# EAGLE board SparkFun_Tsunami_Qwiic (EAGLE 9.6.2)
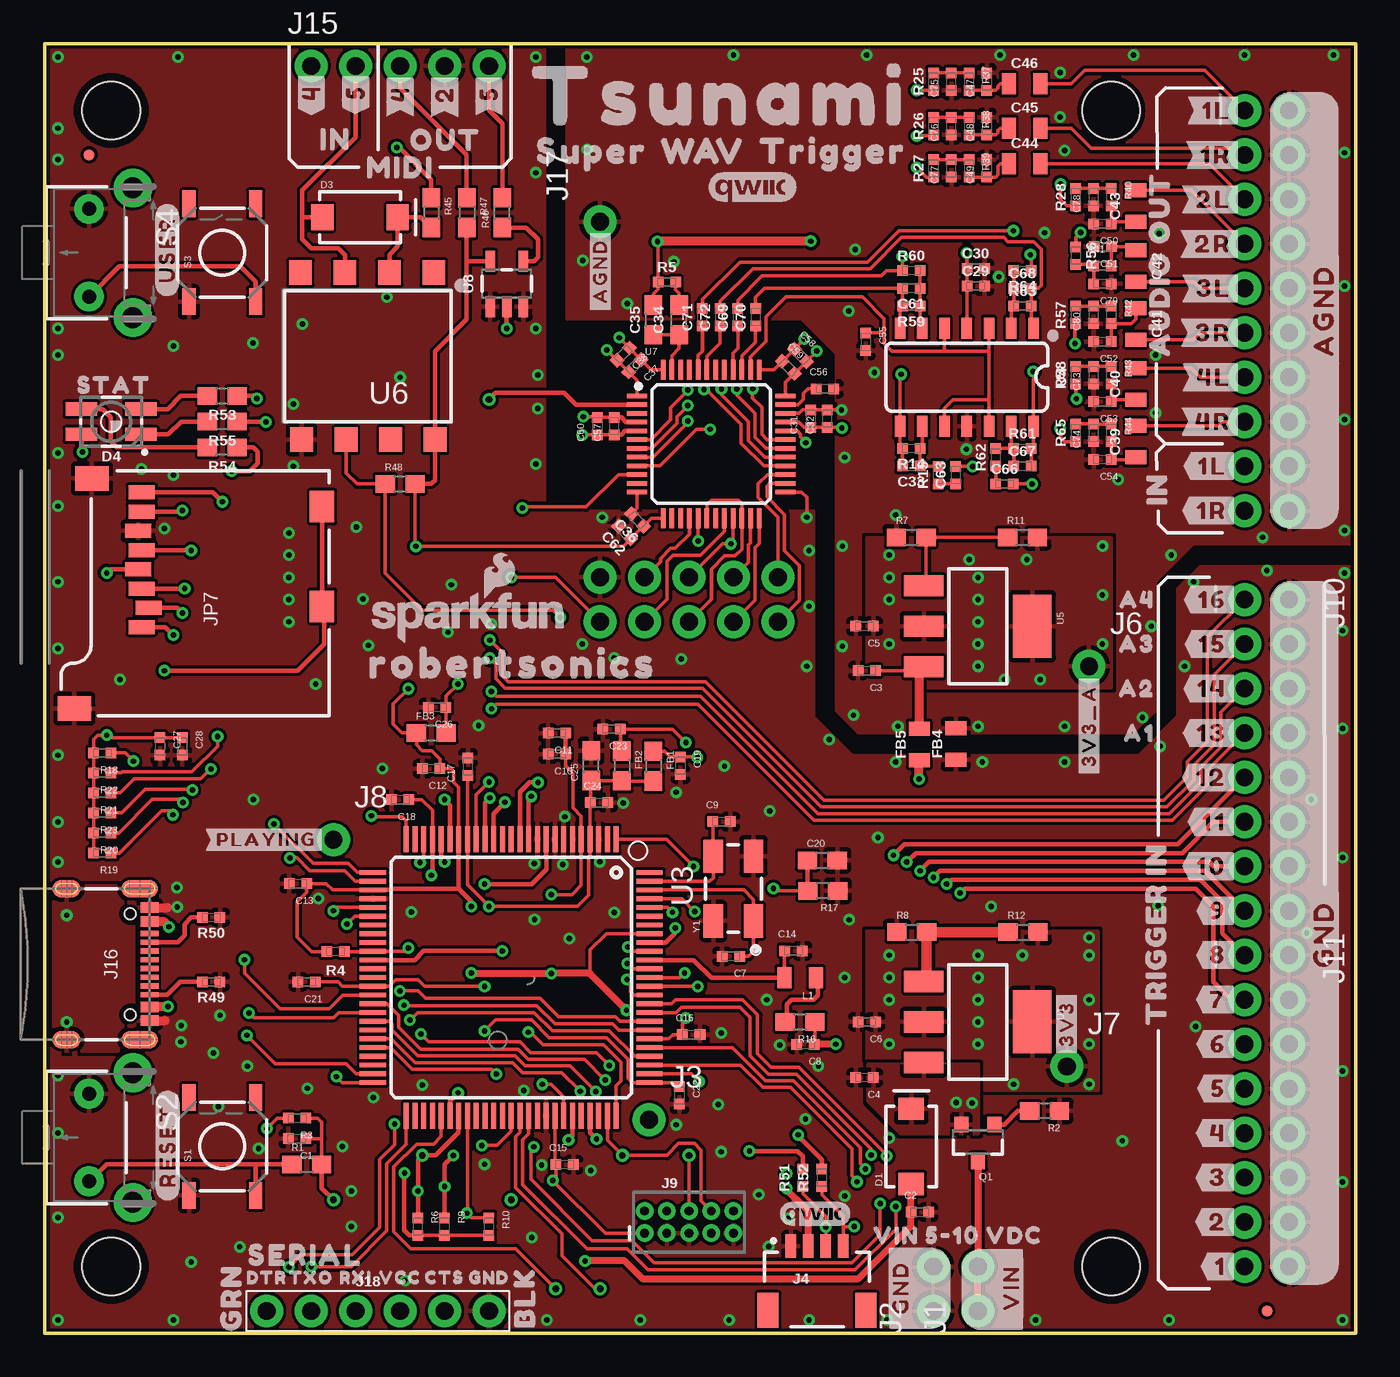
[diagram p2: board, top side]
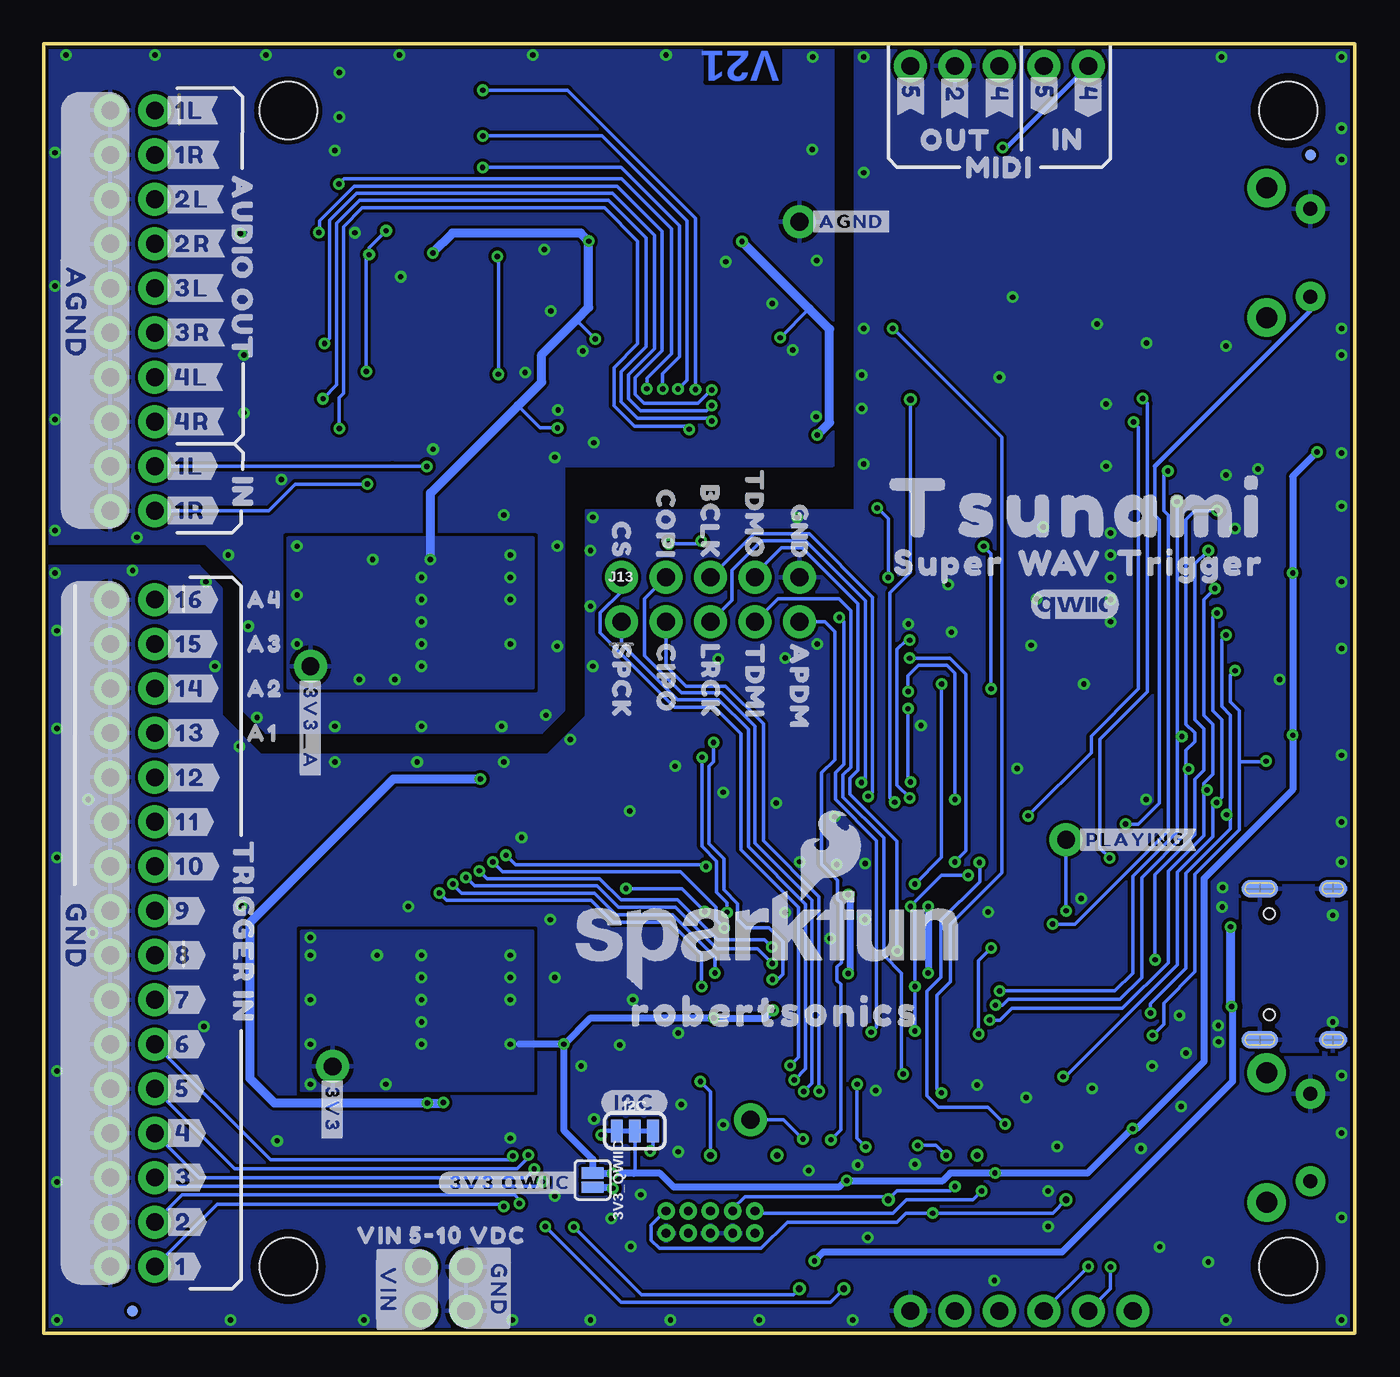
[diagram p3: board, bottom side, seen from below]

Size 74.93 x 73.66 mm. Coordinates in mm from the lower left corner, seen from the top.
Outline: 0,0 74.93,0 74.93,73.66 0,73.66 0,0
Copper layers (1*16): Top 0.035mm / dielectric 1.5mm / Bottom 0.035mm
Design rules "SparkFun-2-Layer-General-JLCPCB": minimum track width 7mil, minimum drill 0.3mm, track to track 7mil, track to pad 7mil, pad to pad 7mil, via to via 7mil, smd to smd 7mil, copper to edge 7mil, drill to drill 7mil, minimum pad ring 7mil, minimum via ring 7mil, stop-mask expansion 3mil, vias tented up to drill 25mil, thermal gap 10mil
tRestrict: area 29.3,27.8 to 29.5,28.6; area 29.8,27.8 to 30,28.6

## Footprints (pad centres in the part's own frame; a part is rotated, then mirrored left to right if it is on the bottom)
SMT-JUMPER_2_NO_SILK = smd 0.635 x 1.27: 1 -0.406,0; 2 0.406,0
0402-TIGHT = smd 0.6 x 0.6: 1 -0.5,0; 2 0.5,0
0603 = smd 1.1 x 1: 1 -0.85,0; 2 0.85,0
0805 = smd 0.8 x 1.2: 1 -0.9,0; 2 0.9,0
SMA-DIODE = smd 1.27 x 1.47: A -2.15,0; C 2.15,0
P-LCC-4-3 = smd 1.8 x 0.75: 1 -1.7,0.725; 2 -1.7,-0.725; 3 1.7,-0.725; 4 1.7,0.725
FIDUCIAL-MICRO = smd 0.635 x 0.635: 1 0,0
STAND-OFF = hole 3.302: 0,0
SMT-JUMPER_3_2-NC_TRACE_SILK = smd 0.66 x 1.27: 1 -1.041,0; 2 0,0; 3 1.041,0
1X02_NO_SILK = drill 1.016 pad 1.88: 1 0,0; 2 2.54,0
1X01_NO_SILK = drill 1.016 pad 1.88: 1 0,0
JST04_1MM_RA = smd 0.6 x 1.35: 1 -1.5,0; 2 -0.5,0; 3 0.5,0; 4 1.5,0 | smd 1.2 x 2: NC1 2.8,-3.675; NC2 -2.8,-3.675
2X5-PTH-1.27MM-NO_SILK = drill 0.508 pad 1: 1 -2.54,-0.635; 2 -2.54,0.635; 3 -1.27,-0.635; 4 -1.27,0.635; 5 0,-0.635; 6 0,0.635; 7 1.27,-0.635; 8 1.27,0.635; 9 2.54,-0.635; 10 2.54,0.635
2X8_NOSILK = drill 1.016 pad 1.88: 1 0,0; 2 0,2.54; 3 2.54,0; 4 2.54,2.54; 5 5.08,0; 6 5.08,2.54; 7 7.62,0; 8 7.62,2.54; 9 10.16,0; 10 10.16,2.54; 11 12.7,0; 12 12.7,2.54; 13 15.24,0; 14 15.24,2.54; 15 17.78,0; 16 17.78,2.54
2X5_NOSILK = drill 1.016 pad 1.88: 1 0,0; 2 0,2.54; 3 2.54,0; 4 2.54,2.54; 5 5.08,0; 6 5.08,2.54; 7 7.62,0; 8 7.62,2.54; 9 10.16,0; 10 10.16,2.54
2X10_NOSILK = drill 1.016 pad 1.88: 1 0,0; 2 0,2.54; 3 2.54,0; 4 2.54,2.54; 5 5.08,0; 6 5.08,2.54; 7 7.62,0; 8 7.62,2.54; 9 10.16,0; 10 10.16,2.54; 11 12.7,0; 12 12.7,2.54; 13 15.24,0; 14 15.24,2.54; 15 17.78,0; 16 17.78,2.54; 17 20.32,0; 18 20.32,2.54; 19 22.86,0; 20 22.86,2.54
1X05_NO_SILK = drill 1.016 pad 1.88: 1 0,0; 2 2.54,0; 3 5.08,0; 4 7.62,0; 5 10.16,0
USB-C-16P-4LAYER-ISOLATED = smd 0.3 x 1: A5 -1.25,-0.34; A6 -0.25,-0.34; A7 0.25,-0.34; A8 1.25,-0.34; B5 1.75,-0.34; B6 0.75,-0.34; B7 -0.75,-0.34; B8 -1.75,-0.34 | smd 0.6 x 1: GND -3.225,-0.34; GND2 3.225,-0.34; VBUS1 -2.45,-0.34; VBUS2 2.45,-0.34 | smd 1 x 2.1: SHLD1 -4.32,-0.915; SHLD2 4.32,-0.915 | smd 1 x 2.1 bottom: SHLD3 -4.32,-0.915; SHLD4 4.32,-0.915 | smd 1 x 1.6: SHLD5 -4.32,-5.095; SHLD8 4.32,-5.095 | smd 1 x 1.6 bottom: SHLD6 -4.32,-5.095; SHLD7 4.32,-5.095 | hole 0.65: -2.89,-1.445; 2.89,-1.445
6_PIN_SERIAL_TARGET_SIDE_W_SILK = drill 1.016 pad 1.88: 1 -6.35,0; 2 -3.81,0; 3 -1.27,0; 4 1.27,0; 5 3.81,0; 6 6.35,0
MICRO-SD-SOCKET-PP = smd 1.8 x 1.4: CD1 -2.05,0.4; CD2 -7.75,0.4 | smd 0.8 x 1.5: CS -7.84,10.3; DI -6.74,10.7; DO -2.34,10.7; GND -3.44,10.9; RSV1 -8.94,10.7; RSV2 -1.24,10.7; SCLK -4.54,10.7; VCC -5.64,10.9 | smd 1.4 x 1.9: GND1 -13.6,14.55; GND3 -0.45,13.55
SOT23-3 = smd 0.8 x 0.9: 1 -0.95,-1; 2 0.95,-1; 3 0,1.1
TACTILE_SWITCH_SMD_5.2MM = smd 1.524 x 0.762: 1 -2.794,1.905; 2 2.794,1.905; 3 -2.794,-1.905; 4 2.794,-1.905
TACTILE_SWITCH_PTH_RIGHT_ANGLE = drill 0.8 pad 1.7: 1 -2.5,0; 2 2.5,0 | drill 1.2 pad 2.2: ANCHOR1 -3.703,2.5; ANCHOR2 3.703,2.5
TP_15TH = drill 0.381 pad 0.61: 1 0,0
SOT223 = smd 1.219 x 2.235: 1 -2.311,-3.099; 2 0,-3.099; 3 2.311,-3.099 | smd 3.6 x 2.2: 4 0,3.099
LQFP100 = smd 1.5 x 0.28: 1 -7.9,6; 2 -7.9,5.5; 3 -7.9,5; 4 -7.9,4.5; 5 -7.9,4; 6 -7.9,3.5; 7 -7.9,3; 8 -7.9,2.5; 9 -7.9,2; 10 -7.9,1.5; 11 -7.9,1; 12 -7.9,0.5; 13 -7.9,0; 14 -7.9,-0.5; 15 -7.9,-1; 16 -7.9,-1.5; 17 -7.9,-2; 18 -7.9,-2.5; 19 -7.9,-3; 20 -7.9,-3.5; 21 -7.9,-4; 22 -7.9,-4.5; 23 -7.9,-5; 24 -7.9,-5.5; 25 -7.9,-6; 51 7.9,-6; 52 7.9,-5.5; 53 7.9,-5; 54 7.9,-4.5; 55 7.9,-4; 56 7.9,-3.5; 57 7.9,-3; 58 7.9,-2.5; 59 7.9,-2; 60 7.9,-1.5; 61 7.9,-1; 62 7.9,-0.5; 63 7.9,0; 64 7.9,0.5; 65 7.9,1; 66 7.9,1.5; 67 7.9,2; 68 7.9,2.5; 69 7.9,3; 70 7.9,3.5; 71 7.9,4; 72 7.9,4.5; 73 7.9,5; 74 7.9,5.5; 75 7.9,6 | smd 0.28 x 1.5: 26 -6,-7.9; 27 -5.5,-7.9; 28 -5,-7.9; 29 -4.5,-7.9; 30 -4,-7.9; 31 -3.5,-7.9; 32 -3,-7.9; 33 -2.5,-7.9; 34 -2,-7.9; 35 -1.5,-7.9; 36 -1,-7.9; 37 -0.5,-7.9; 38 0,-7.9; 39 0.5,-7.9; 40 1,-7.9; 41 1.5,-7.9; 42 2,-7.9; 43 2.5,-7.9; 44 3,-7.9; 45 3.5,-7.9; 46 4,-7.9; 47 4.5,-7.9; 48 5,-7.9; 49 5.5,-7.9; 50 6,-7.9; 76 6,7.9; 77 5.5,7.9; 78 5,7.9; 79 4.5,7.9; 80 4,7.9; 81 3.5,7.9; 82 3,7.9; 83 2.5,7.9; 84 2,7.9; 85 1.5,7.9; 86 1,7.9; 87 0.5,7.9; 88 0,7.9; 89 -0.5,7.9; 90 -1,7.9; 91 -1.5,7.9; 92 -2,7.9; 93 -2.5,7.9; 94 -3,7.9; 95 -3.5,7.9; 96 -4,7.9; 97 -4.5,7.9; 98 -5,7.9; 99 -5.5,7.9; 100 -6,7.9
SO14 = smd 0.6 x 1.2: 1 -3.175,-2.8; 2 -1.905,-2.8; 3 -0.635,-2.8; 4 0.635,-2.8; 5 1.905,-2.8; 6 3.175,-2.8; 7 4.445,-2.8; 8 4.445,2.8; 9 3.175,2.8; 10 1.905,2.8; 11 0.635,2.8; 12 -0.635,2.8; 13 -1.905,2.8; 14 -3.175,2.8
8-SMD = smd 1.3 x 1.4: 1 -3.96,-4.96; 2 -1.42,-4.96; 3 1.12,-4.96; 4 3.66,-4.96; 5 3.59,4.58; 6 1.05,4.58; 7 -1.49,4.58; 8 -4.03,4.58
LQFP-48 = smd 1.143 x 0.254: 1 -4.25,2.75; 2 -4.25,2.25; 3 -4.25,1.75; 4 -4.25,1.25; 5 -4.25,0.75; 6 -4.25,0.25; 7 -4.25,-0.25; 8 -4.25,-0.75; 9 -4.25,-1.25; 10 -4.25,-1.75; 11 -4.25,-2.25; 12 -4.25,-2.75; 25 4.25,-2.75; 26 4.25,-2.25; 27 4.25,-1.75; 28 4.25,-1.25; 29 4.25,-0.75; 30 4.25,-0.25; 31 4.25,0.25; 32 4.25,0.75; 33 4.25,1.25; 34 4.25,1.75; 35 4.25,2.25; 36 4.25,2.75 | smd 0.254 x 1.143: 13 -2.75,-4.25; 14 -2.25,-4.25; 15 -1.75,-4.25; 16 -1.25,-4.25; 17 -0.75,-4.25; 18 -0.25,-4.25; 19 0.25,-4.25; 20 0.75,-4.25; 21 1.25,-4.25; 22 1.75,-4.25; 23 2.25,-4.25; 24 2.75,-4.25; 37 2.75,4.25; 38 2.25,4.25; 39 1.75,4.25; 40 1.25,4.25; 41 0.75,4.25; 42 0.25,4.25; 43 -0.25,4.25; 44 -0.75,4.25; 45 -1.25,4.25; 46 -1.75,4.25; 47 -2.25,4.25; 48 -2.75,4.25
SOT23-5 = smd 0.55 x 1.2: 1 -0.95,-1.3; 2 0,-1.3; 3 0.95,-1.3; 4 0.95,1.3; 5 -0.95,1.3
CRYSTAL-OSC-SMD-5X3 = smd 1.9 x 1.1: 1 -1.85,-1.15; 2 1.85,-1.15; 3 1.85,1.15; 4 -1.85,1.15

## Placement (x,y rotation side)
3V3_QWIIC  [SMT-JUMPER_2_NO_SILK]  43.57,8.75 270 bottom
C1  10nF  [0402-TIGHT]  14.43,11.12 180 top
C2  10uF  [0402-TIGHT]  50.02,6.91 0 top
C3  0.1uF  [0402-TIGHT]  46.99,37.85 180 top
C4  0.1uF  [0402-TIGHT]  46.86,14.61 180 top
C5  10uF  [0402-TIGHT]  46.86,40.39 180 top
C6  10uF  [0402-TIGHT]  46.99,17.78 180 top
C7  12pF  [0402-TIGHT]  39.22,21.53 180 top
C8  0.1uF  [0402-TIGHT]  43.49,16.5 180 top
C9  12pF  [0402-TIGHT]  38.69,29.22 0 top
C10  0.1uF  [0402-TIGHT]  29.28,33.08 180 top
C11  10uF  [0402-TIGHT]  29.28,34.28 180 top
C12  0.1uF  [0402-TIGHT]  22.1,32.26 180 top
C13  0.1uF  [0402-TIGHT]  14.48,25.68 180 top
C14  4.7uF  [0402-TIGHT]  42.8,21.84 0 top
C15  0.1uF  [0402-TIGHT]  29.72,9.63 0 top
C16  0.1uF  [0402-TIGHT]  36.96,17.05 0 top
C17  0.1uF  [0402-TIGHT]  24.19,32.37 90 top
C18  0.1uF  [0402-TIGHT]  20.32,30.48 180 top
C19  0.1uF  [0402-TIGHT]  36.34,32.43 270 top
C20  10pF  [0603]  44.45,27.02 0 top
C21  0.1uF  [0402-TIGHT]  14.99,20.07 180 top
C22  0.1uF  [0402-TIGHT]  36.28,13.58 270 top
C23  0.1uF  [0402-TIGHT]  32.41,34.51 180 top
C24  0.1uF  [0402-TIGHT]  31.69,30.31 0 top
C25  2.2uF  [0603]  31.24,32.42 90 top
C26  0.1uF  [0402-TIGHT]  22.44,35.76 180 top
C27  10uF  [0402-TIGHT]  6.6,33.53 270 top
C28  0.1uF  [0402-TIGHT]  7.87,33.53 270 top
C29  0.1uF  [0402-TIGHT]  53.21,59.82 0 top
C30  1.0uF  [0402-TIGHT]  53.21,60.83 0 top
C31  0.1uF  [0402-TIGHT]  43.79,52.25 90 top
C32  1.0uF  [0402-TIGHT]  44.73,52.25 90 top
C33  100pF  [0402-TIGHT]  49.53,49.53 180 top
C34  5.6nF  [0603]  36.27,57.89 90 top
C35  390nF  [0603]  34.8,57.89 90 top
C36  0.1uF  [0402-TIGHT]  33.88,46.46 135 top
C37  0.1uF  [0402-TIGHT]  33.73,55.26 225 top
C38  1.0uF  [0402-TIGHT]  33.07,55.93 225 top
C39  22uF  [0805]  62.36,50.93 90 top
C40  22uF  [0805]  62.36,54.23 90 top
C41  22uF  [0805]  62.36,57.66 270 top
C42  22uF  [0805]  62.36,60.96 270 top
C43  22uF  [0805]  62.36,64.39 90 top
C44  22uF  [0805]  56.01,66.8 0 top
C45  22uF  [0805]  56.01,68.83 0 top
C46  22uF  [0805]  56.01,71.37 0 top
C47  0.1uF  [0402-TIGHT]  53.85,71.5 90 top
C48  0.1uF  [0402-TIGHT]  53.85,68.96 90 top
C49  0.1uF  [0402-TIGHT]  53.85,66.55 90 top
C50  0.1uF  [0402-TIGHT]  60.45,63.37 180 top
C51  0.1uF  [0402-TIGHT]  60.46,62.06 180 top
C52  0.1uF  [0402-TIGHT]  60.45,56.64 180 top
C53  0.1uF  [0402-TIGHT]  60.45,53.21 180 top
C54  0.1uF  [0402-TIGHT]  60.45,49.91 180 top
C55  0.1uF  [0402-TIGHT]  46.94,56.63 270 top
C56  0.1uF  [0402-TIGHT]  44.61,53.95 0 top
C57  0.1uF  [0402-TIGHT]  32.56,51.82 90 top
C58  1.0uF  [0402-TIGHT]  43.2,55.86 315 top
C59  0.1uF  [0402-TIGHT]  42.51,55.18 315 top
C60  1.0uF  [0402-TIGHT]  31.6,51.82 90 top
C61  100pF  [0402-TIGHT]  49.53,59.69 180 top
C62  1.0uF  [0402-TIGHT]  33.15,45.75 135 top
C63  1.0uF  [0402-TIGHT]  52.07,49.02 90 top
C66  1.0uF  [0402-TIGHT]  54.86,48.51 0 top
C67  100pF  [0402-TIGHT]  55.88,49.53 0 top
C68  100pF  [0402-TIGHT]  55.88,59.69 0 top
C69  1.0uF  [0402-TIGHT]  39.62,58.04 90 top
C70  1.0uF  [0402-TIGHT]  40.64,58.04 90 top
C71  1.0uF  [0402-TIGHT]  37.59,58.04 90 top
C72  1.0uF  [0402-TIGHT]  38.61,58.04 90 top
C73  0.1uF  [0402-TIGHT]  59.94,54.74 90 top
C74  0.1uF  [0402-TIGHT]  59.94,51.44 90 top
C75  0.1uF  [0402-TIGHT]  51.82,71.5 90 top
C76  0.1uF  [0402-TIGHT]  51.82,68.96 90 top
C77  0.1uF  [0402-TIGHT]  51.82,66.55 90 top
C78  0.1uF  [0402-TIGHT]  59.94,64.9 90 top
C79  0.1uF  [0402-TIGHT]  60.45,59.94 180 top
C80  0.1uF  [0402-TIGHT]  59.94,58.17 90 top
D1  1A/40V/500mV  [SMA-DIODE]  49.53,10.67 90 top
D3  1A/40V/500mV  [SMA-DIODE]  18.03,63.75 0 top
D4  RGB  [P-LCC-4-3]  3.81,52.07 180 top
FB1  470Ω  [0603]  34.79,32.39 270 top
FB2  470Ω  [0603]  32.99,32.41 270 top
FB3  470Ω  [0603]  22.1,34.29 0 top
FB4  600Ω  [0805]  52.07,33.66 90 top
FB5  600Ω  [0805]  49.98,33.63 90 top
FD1  FIDUCIALUFIDUCIAL  [FIDUCIAL-MICRO]  69.85,1.27 0 top
FD2  FIDUCIALUFIDUCIAL  [FIDUCIAL-MICRO]  2.54,67.31 0 top
FD3  FIDUCIALUFIDUCIAL  [FIDUCIAL-MICRO]  2.54,67.31 0 bottom
FD4  FIDUCIALUFIDUCIAL  [FIDUCIAL-MICRO]  69.85,1.27 0 bottom
FRAME1  FRAME-LEDGER  [CREATIVE_COMMONS]  -1.27,-31.75 0 top  (outside the outline)
FRAME2  FRAME-LEDGER  [CREATIVE_COMMONS]  -1.27,-31.75 0 top  (outside the outline)
H1  STAND-OFF  [STAND-OFF]  3.81,69.85 0 top
H2  STAND-OFF  [STAND-OFF]  60.96,3.81 0 top
H3  STAND-OFF  [STAND-OFF]  3.81,3.81 0 top
H4  STAND-OFF  [STAND-OFF]  60.96,69.85 0 top
I2C  [SMT-JUMPER_3_2-NC_TRACE_SILK]  41.15,11.55 0 bottom
J1  VDC-IN  [1X02_NO_SILK]  53.34,1.27 90 top
J2  GND-IN  [1X02_NO_SILK]  50.8,1.27 90 top
J3  DEBUG  [1X01_NO_SILK]  34.54,12.19 0 top
J4  QWIIC  [JST04_1MM_RA]  44.15,4.98 0 top
J6  3.3VA  [1X01_NO_SILK]  59.69,38.1 0 top
J7  3.3V  [1X01_NO_SILK]  58.42,15.24 0 top
J8  PLAYING  [1X01_NO_SILK]  16.51,28.19 0 top
J9  CORTEX_JTAG_DEBUG_PTH_NS  [2X5-PTH-1.27MM-NO_SILK]  36.83,6.35 0 top
J10  TRIG2  [2X8_NOSILK]  68.58,41.91 270 top
J11  TRIG1  [2X8_NOSILK]  68.58,21.59 270 top
J13  [2X5_NOSILK]  41.91,40.64 0 bottom
J14  AUDIO I/O  [2X10_NOSILK]  68.58,69.85 270 top
J15  MIDI  [1X05_NO_SILK]  15.24,72.39 0 top
J16  USB-C  [USB-C-16P-4LAYER-ISOLATED]  6.35,21.08 270 top
J17  AGND  [1X01_NO_SILK]  31.75,63.5 90 top
J18  [6_PIN_SERIAL_TARGET_SIDE_W_SILK]  19.05,1.27 0 top
JP7  USD-SOCKETNEW  [MICRO-SD-SOCKET-PP]  16.26,49.28 90 top
L1  10μH  [0805]  43.18,20.32 180 top
LOGO2  SFE_LOGO_NAME_FLAME.2_INCH  [SFE_LOGO_NAME_FLAME_.2]  33.53,22.48 0 bottom
LOGO3  QWIIC_LOGO_4MM  [QWIIC_4MM]  44.04,6.81 0 top
Q1  3.1A/30V/105mΩ  [SOT23-3]  53.34,10.92 180 top
R1  33  [0603]  14.99,9.65 0 top
R2  1M  [0603]  57.15,12.7 180 top
R3  10k  [0402-TIGHT]  14.44,12.28 180 top
R4  10k  [0402-TIGHT]  16.63,21.8 180 top
R5  560Ω  [0402-TIGHT]  35.56,60.05 0 top
R6  100k  [0402-TIGHT]  21.34,6.1 270 top
R7  390  [0603]  49.53,45.47 0 top
R8  390  [0603]  49.56,22.91 0 top
R9  100k  [0402-TIGHT]  22.86,6.1 270 top
R10  100k  [0402-TIGHT]  25.4,6.1 270 top
R11  240  [0603]  55.88,45.47 0 top
R12  240  [0603]  55.91,22.91 0 top
R14  33k  [0402-TIGHT]  49.53,50.55 180 top
R15  33k  [0402-TIGHT]  51.05,49.02 90 top
R16  2.2  [0603]  43.18,17.78 180 top
R17  5.62k  [0603]  44.47,25.28 180 top
R18  10k  [0402-TIGHT]  3.3,33.15 180 top
R19  100k  [0402-TIGHT]  3.3,27.43 180 top
R20  100k  [0402-TIGHT]  3.3,28.57 180 top
R21  100k  [0402-TIGHT]  3.3,30.86 180 top
R22  100k  [0402-TIGHT]  3.3,32 180 top
R23  10k  [0402-TIGHT]  3.3,29.72 180 top
R25  10Ω  [0402-TIGHT]  50.8,71.5 90 top
R26  10Ω  [0402-TIGHT]  50.8,68.96 90 top
R27  10Ω  [0402-TIGHT]  50.8,66.55 90 top
R28  10Ω  [0402-TIGHT]  58.93,64.9 90 top
R37  10Ω  [0402-TIGHT]  52.83,71.5 270 top
R38  10Ω  [0402-TIGHT]  52.83,68.96 270 top
R39  10Ω  [0402-TIGHT]  52.83,66.55 270 top
R40  10Ω  [0402-TIGHT]  60.96,64.9 270 top
R41  10Ω  [0402-TIGHT]  60.45,60.96 0 top
R42  10Ω  [0402-TIGHT]  60.96,58.17 270 top
R43  10Ω  [0402-TIGHT]  60.96,54.74 270 top
R44  10Ω  [0402-TIGHT]  60.96,51.44 270 top
R45  220  [0603]  22.1,64.01 270 top
R46  220  [0603]  26.16,64.01 90 top
R47  220  [0603]  24.13,64.01 270 top
R48  220  [0603]  20.32,48.51 0 top
R49  5.1k  [0402-TIGHT]  9.53,20.07 180 top
R50  5.1k  [0402-TIGHT]  9.53,23.75 180 top
R51  2.2k  [0402-TIGHT]  43.33,8.88 90 top
R52  2.2k  [0402-TIGHT]  44.42,8.89 90 top
R53  100  [0603]  10.16,53.54 180 top
R54  100  [0603]  10.15,50.6 180 top
R55  220  [0603]  10.16,52.07 180 top
R56  10Ω  [0402-TIGHT]  58.94,61.55 270 top
R57  10Ω  [0402-TIGHT]  58.93,58.17 90 top
R58  10Ω  [0402-TIGHT]  58.93,54.74 90 top
R59  33k  [0402-TIGHT]  49.53,58.67 180 top
R60  33k  [0402-TIGHT]  49.53,60.71 0 top
R61  33k  [0402-TIGHT]  55.88,50.55 0 top
R62  33k  [0402-TIGHT]  54.36,50.04 90 top
R63  33k  [0402-TIGHT]  55.88,58.67 0 top
R64  33k  [0402-TIGHT]  55.88,60.71 180 top
R65  10Ω  [0402-TIGHT]  58.93,51.44 90 top
S1  Reset  [TACTILE_SWITCH_SMD_5.2MM]  10.16,10.67 90 top
S2  DNP  [TACTILE_SWITCH_PTH_RIGHT_ANGLE]  2.54,11.18 270 top
S3  User  [TACTILE_SWITCH_SMD_5.2MM]  10.16,61.72 90 top
S4  DNP  [TACTILE_SWITCH_PTH_RIGHT_ANGLE]  2.54,61.72 270 top
TP1  I2C_SCK  [TP_15TH]  29.21,2.54 90 top
TP2  I2C_SDA  [TP_15TH]  31.75,2.54 90 top
TP4  MCLK  [TP_15TH]  25.4,53.34 0 top
TP5  SWDIO/TMS  [TP_15TH]  21.59,10.16 90 top
TP6  SWCK/TCK  [TP_15TH]  26.67,7.62 90 top
TP7  TDO  [TP_15TH]  36.83,10.16 90 top
TP8  TDI  [TP_15TH]  33.02,10.16 90 top
TP9  NRESET  [TP_15TH]  16.51,7.62 0 top
U1  LM1117  [SOT223]  53.34,17.78 270 top
U3  ATSAMS70NXXA-AN  [LQFP100]  26.67,20.32 270 top
U4  LMV324  [SO14]  53.34,54.61 180 top
U5  LM1117  [SOT223]  53.34,40.39 270 top
U6  6N138M  [8-SMD]  18.29,55.63 180 top
U7  ADAU1328  [LQFP-48]  38.1,50.8 0 top
U8  74AHC1G125W5-7  [SOT23-5]  26.42,59.94 0 top
U$3  [GND_0]  31.75,48.01 270 bottom
U$4  [QWIIC_5MM]  40.43,65.49 0 top
U$5  [STAT0]  3.99,54.15 0 top
U$6  [#USER#0]  7.01,61.87 90 top
U$7  [#RESET#0]  7.04,10.72 90 top
U$8  [ROBERTSONICS0]  26.75,38.25 0 top
U$9  [ROBERTSONICS0]  33.12,18.36 0 bottom
U$10  [#2L#0]  68.58,64.77 0 top
U$11  [#1L#0]  68.58,69.85 0 top
U$12  [#1R#0]  68.58,67.31 0 top
U$13  [#2R#0]  68.58,62.23 0 top
U$14  [#3R#0]  68.58,57.15 0 top
U$15  [#3L#0]  68.58,59.69 0 top
U$16  [#4L#0]  68.58,54.61 0 top
U$17  [#4R#0]  68.58,52.07 0 top
U$18  [#4#3]  20.32,72.08 90 top
U$19  [#2#5]  22.86,72.08 90 top
U$20  [AUDIO_OUT0]  63.73,61.09 90 top
U$21  [IN0]  63.57,48.23 90 top
U$22  [TRIGGER_IN0]  63.52,22.81 90 top
U$23  [#GND#0]  73.1,22.79 90 top
U$24  [#1#0]  68.33,3.82 0 top
U$25  [SERIAL3]  14.9,4.46 0 top
U$26  [SUPER0]  23.18,44 0 bottom
U$27  [VIN_5#10_VDC0]  52.2,5.59 0 bottom
U$28  [#AGND#0]  73.1,58.42 90 top
U$29  [#2#0]  68.33,6.36 0 top
U$30  [#3#0]  68.33,8.9 0 top
U$31  [#4#0]  68.33,11.44 0 top
U$32  [#5#0]  68.33,13.98 0 top
U$33  [#6#0]  68.33,16.52 0 top
U$34  [#7#0]  68.33,19.06 0 top
U$35  [#8#0]  68.33,21.6 0 top
U$36  [#9#0]  68.33,24.14 0 top
U$37  [#10#0]  68.33,26.68 0 top
U$38  [#11#0]  68.33,29.22 0 top
U$39  [#12#0]  68.33,31.76 0 top
U$40  [#PLAYING#30]  16,28.19 0 bottom
U$41  [#3V3#0]  58.45,14.71 270 bottom
U$43  [#13#0]  68.35,34.29 0 top
U$44  [#3V3_A#0]  59.69,37.66 90 top
U$45  [MIDI0]  20.32,66.59 0 top
U$46  [IN0]  16.62,68.21 0 top
U$47  [OUT0]  22.94,68.15 0 top
U$48  [#14#0]  68.35,36.83 0 top
U$49  [#15#0]  68.35,39.37 0 top
U$50  [#16#0]  68.35,41.91 0 top
U$51  [A10]  64.15,34.29 0 top
U$52  [A20]  64.15,36.83 0 top
U$53  [A30]  64.15,39.37 0 top
U$54  [A40]  64.15,41.91 0 top
U$55  [#5#6]  25.4,72.08 270 bottom
U$56  [#4#0]  15.24,72.14 90 top
U$57  [#2#6]  22.87,72 270 bottom
U$58  [#5#0]  17.78,72.14 90 top
U$59  [#4#6]  20.32,72.01 270 bottom
U$60  [SUPER0]  31.28,67.54 0 top
U$61  [#GND#1]  48.93,2.6 90 top
U$62  [TRIGGER0]  45.07,67.54 0 top
U$63  [TSUNAMI0]  38.61,70.67 0 top
U$64  [W0]  36.3,67.53 0 top
U$65  [A0]  37.93,67.53 0 top
U$66  [V0]  39.23,67.52 0 top
U$67  [#VIN#2]  55.24,2.59 90 top
U$68  [TRIGGER0]  9.39,44 0 bottom
U$69  [TSUNAMI0]  15.85,47.13 0 bottom
U$70  [W0]  18.16,43.99 0 bottom
U$71  [A0]  16.53,43.99 0 bottom
U$72  [V0]  15.23,43.98 0 bottom
U$73  [QWIIC_5MM]  16.02,41.66 0 bottom
U$74  [#16#5]  68.2,41.91 0 bottom
U$75  [#15#17]  68.2,39.37 0 bottom
U$76  [#14#17]  68.2,36.83 0 bottom
U$77  [#13#17]  68.2,34.29 0 bottom
U$78  [#12#17]  68.2,31.75 0 bottom
U$79  [#11#17]  68.2,29.21 0 bottom
U$80  [#10#17]  68.2,26.67 0 bottom
U$81  [#9#17]  68.2,24.13 0 bottom
U$82  [#8#17]  68.2,21.59 0 bottom
U$83  [#7#17]  68.2,19.05 0 bottom
U$84  [#AGND#0]  73.1,58.29 270 bottom
U$85  [#GND#0]  73.1,22.67 270 bottom
U$86  [CS17]  41.94,43.45 270 bottom
U$87  [BCLK19]  36.86,43.45 270 bottom
U$88  [COPI18]  39.4,43.45 270 bottom
U$89  [TDMO20]  34.32,43.45 270 bottom
U$91  [SPCK22]  41.92,40.15 270 bottom
U$92  [TDMI25]  34.3,40.15 270 bottom
U$93  [LRCK24]  36.84,40.15 270 bottom
U$94  [CIPO23]  39.38,40.15 270 bottom
U$95  [APDM26]  31.76,40.15 270 bottom
U$96  [#AGND#27]  31.75,63.12 90 top
U$97  [#AGND#28]  31.24,63.5 0 bottom
U$98  [#PLAYING#29]  16.13,28.19 0 top
U$99  [VIN_5#10_VDC0]  52.2,5.59 0 top
U$102  [A117]  64.01,34.29 0 bottom
U$103  [A2118]  64.01,36.83 0 bottom
U$104  [A32119]  64.01,39.37 0 bottom
U$105  [A432120]  64.01,41.91 0 bottom
U$106  [TRIGGER_IN0]  63.52,22.91 270 bottom
U$107  [AUDIO_OUT0]  63.6,60.83 270 bottom
U$108  [IN0]  63.57,48.03 270 bottom
U$110  [#GND#1]  48.94,2.48 270 bottom
U$111  [#VIN#2]  55.24,2.48 270 bottom
U$112  [#3V3#0]  58.41,15.74 90 top
U$113  [#I2C#6]  41.18,13.18 0 bottom
U$116  [#1L#3]  68.35,49.53 0 top
U$117  [#4#0]  15.24,72.03 270 bottom
U$118  [#5#0]  17.77,72.09 270 bottom
U$119  [#1L#6]  68.23,69.86 0 bottom
U$120  [#1R#0]  68.23,67.32 0 bottom
U$121  [#1R#2]  68.23,47 0 bottom
U$122  [MIDI0]  20.32,66.59 0 bottom
U$123  [IN0]  16.4,68.21 0 bottom
U$124  [OUT0]  22.78,68.15 0 bottom
U$141  [SFE_LOGO_NAME_FLAME_.1]  24.26,40.89 0 top
U$162  [#3V3_A#4]  59.7,37.54 270 bottom
U$163  [#3V3_QWIIC#0]  44.21,8.6 0 bottom
U$164  [#1R#3]  68.35,46.99 0 top
U$165  [#5#5]  25.4,72.08 90 top
U$166  [#1L#2]  68.23,49.54 0 bottom
U$167  [#2L#0]  68.23,64.78 0 bottom
U$168  [#2R#3]  68.23,62.24 0 bottom
U$169  [#3L#3]  68.23,59.7 0 bottom
U$170  [#3R#4]  68.23,57.16 0 bottom
U$171  [#4L#4]  68.23,54.62 0 bottom
U$172  [#4R#5]  68.23,52.08 0 bottom
U$173  [#6#17]  68.2,16.51 0 bottom
U$174  [#5#17]  68.2,13.97 0 bottom
U$175  [#4#17]  68.2,11.43 0 bottom
U$176  [#3#17]  68.2,8.89 0 bottom
U$177  [#2#17]  68.2,6.35 0 bottom
U$178  [#1#17]  68.2,3.81 0 bottom
Y1  11.2896 MHz  [CRYSTAL-OSC-SMD-5X3]  39.37,25.4 90 top

## Tracks (layer width: path | path; a pad name or v marks a point on that pad's centre or on a via)
3.3V  (via drill 0.3)
  Top 0.203: v28.96,25.06 30.14,25.06 30.67,25.59 U3.5 30.67,29.54 30.2,30 30.2,32 29.78,32.43 C10.1 | R19.2 R20.2 R23.2 R21.2 R22.2 R18.2 2.8,33.92 3.05,34.16 v3.56,34.16 3.68,34.03 C27.1 C28.1 | D4.4 2.16,51.34 v2.16,50.34 | U3.68 29.17,9.69 C15.1 29.22,8.9 v29.04,8.72 32.05,5.71 J9.1 | U3.81 35.67,16.82 35.9,17.05 C16.1 36.46,17.82 v36.64,18 | R3.2 13.3,12.28 v12.7,11.68 | R4.2 15.26,21.8 14.44,22.62 14.44,24.66 14.98,25.2 C13.1 16.1,25.68 16.46,25.32 19.05,25.32 | U3.19 23.67,31.19 23.38,31.48 23.38,32.11 23.23,32.26 C12.1 22.6,32.8 22.13,33.27 21.59,33.27 21.25,33.62 FB3.1 20.42,34.29 19.92,34.78 19.92,35.95 v20.79,36.81 | C8.1 44.03,16.54 R16.1 | U3.93 32.11,22.82 31.18,21.89 31.18,20.55 | R48.2 21.17,45.01 v21.22,44.95 21.23,44.97 33.08,44.97 C62.1 34.21,46.1 C36.1 34.68,46.55 U7.13 | R6.2 R9.2 R10.2
  Top 0.254: C11.1 C10.1 | U3.19 23.67,25.4 | 23.67,25.4 23.67,25.39 24.38,24.68 v24.38,24.38 | U3.28 19.05,25.32 19.73,25.32 19.81,25.4 23.67,25.4 | JP7.VCC 3.76,43.64 v3.56,43.43 | R6.2 20.82,5.6 20.55,5.87 20.55,9.12 v20.57,9.14 | R48.2 22.1,48.51 22.32,48.73 U6.8 22.32,56.1 24.13,57.91 24.13,61.21 | U8.5 24.16,61.24 24.13,61.21 | 24.13,61.21 R47.2
  Top 0.406: v45.21,16.51 v45.2,16.5 C8.1 | v24.38,20.57 24.41,20.55 v28.95,20.55 v28.96,20.55 31.16,20.55 | v33.26,18.45 31.16,20.55 | 31.18,20.55 31.16,20.55
  Bottom 0.203: v21.22,44.95 20.79,44.52 v20.79,36.81 | 41.21,9.13 41.15,9.19 I2C.2
  Bottom 0.406: v28.96,25.06 28.86,24.96 28.86,20.66 v28.96,20.55 | v24.38,24.38 v24.38,20.57 | v2.16,50.34 3.56,48.95 v3.56,43.43 v3.56,34.16 3.56,31.05 8.64,25.97 8.64,15.52 12.47,11.68 v12.7,11.68 12.74,11.68 15.28,9.14 v20.57,9.14 23.13,9.14 23.55,8.72 v29.04,8.72 29.12,8.72 29.5,8.35 38.92,8.35 39.7,9.13 41.21,9.13 v42.42,9.13 43.54,9.13 3V3_QWIIC.1 43.57,9.95 45.21,11.6 v45.21,16.51 | v45.21,16.51 47.75,16.51 | v45.21,16.51 45.18,16.51 43.68,18.01 36.65,18.01 v36.64,18 33.71,18 v33.26,18.45
  other vias: 53.34,17.78 59.69,14.22 55.37,14.22 59.69,16.51 59.69,19.05 59.69,21.59 55.88,21.59 48.26,21.59 59.69,22.61 48.26,20.32 48.26,19.05 48.26,16.51 53.34,19.05 53.34,20.32 53.34,21.59 53.34,16.51
  pour Top (rank 2): 46.99,13.84 46.99,22.99 60.2,22.99 60.2,13.84
  pour Bottom: 60.2,13.84 60.2,22.99 46.99,22.99 46.99,13.84
56
  Top 0.254: R45.2 21.5,63.75 D3.C 20.18,62.09 19.71,61.62 U6.2
ADC1LN
  Top 0.203: C69.1 39.62,56.25 39.35,55.98 U7.40
ADC1LP
  Top 0.203: U7.39 39.85,55.83 40.64,56.62 C70.1
ADC2LN
  Top 0.203: U7.44 37.35,55.86 37.59,56.11 C71.1
ADC2LP
  Top 0.203: U7.43 37.85,55.81 38.61,56.57 C72.1
AGND  (via drill 0.3)
  Top 0.203: v30.79,52.36 31.57,52.36 C60.2 C57.2 | U7.1 33.85,54.44 C37.2 C38.2 v32.14,56.16 | U7.32 43.02,51.55 43.21,51.36 43.21,51.2 43.5,50.92 v43.5,50.87 | v45.54,52.73 45.52,52.75 C32.2 C31.2 43.32,52.75 43.13,52.55 U7.34 | U7.36 42.35,54.31 C59.2 C58.2 43.55,55.52 v44.13,56.1
  Top 0.254: U7.4 33.24,52.05 32.97,52.32 C57.2
  other vias: 33.29,58.81 30.99,72.9 31.02,67.62 30.77,61.27 46.99,73.03 39.37,73.03 54.61,73.03 62.23,73.03 68.58,73.03 73.66,73.03 74.3,67.44 74.3,59.82 74.3,52.2 74.3,45.85 69.6,45.47 64.39,44.45 63.25,40.39 62.74,35.18 58.29,34.67 53.34,34.67 48.77,34.67 46.23,35.31 45.59,39.24 45.59,44.96 45.72,50.04 47.42,54.89 45.96,58.39 52.68,50.5 63.5,52.58 61.34,48.77 63.5,55.88 57.15,62.87 63.69,62.83 58.29,67.56 58.04,69.47 58.04,72.01 48.64,46.74 35.95,61.21 46.33,61.91 54.53,60.35
  pour Bottom (rank 2): 29.84,73.66 29.84,49.53 45.21,49.53 45.21,35.56 46.48,34.29 62.23,34.29 63.5,35.56 63.5,42.92 65.68,45.1 74.93,45.1 74.93,73.66
  pour Top (rank 2): 29.84,73.66 29.84,57.94 43.23,57.94 45.21,55.96 45.21,35.56 46.48,34.29 62.23,34.29 63.5,35.56 63.5,42.93 65.67,45.1 74.93,45.1 74.93,73.66
AIN1L  (via drill 0.3)
  Top 0.203: v53.04,49.52 C63.2
  Bottom 0.203: J14.17 55,49.53 53.05,49.53 v53.04,49.52
AIN1R  (via drill 0.3)
  Top 0.203: C66.2 v56.44,48.51
  Bottom 0.203: v56.44,48.51 59.64,48.51 60.56,48.51 62.08,46.99 J14.19
AOUT1L
  Top 0.203: R37.2 C47.1 54.36,71 54.48,71.12 54.48,71.25 54.61,71.37 C46.1
AOUT1R
  Top 0.203: R38.2 C48.1 54.36,68.46 54.48,68.58 54.48,68.71 54.61,68.83 C45.1
AOUT2L
  Top 0.203: J14.5 66.55,66.8 C44.2
AOUT2R
  Top 0.203: R40.2 60.96,63.38 C50.1 61.07,63.49 C43.1
AOUT3L
  Top 0.203: J14.9 66.04,59.69 65.67,60.06 C42.2
AOUT3R
  Top 0.203: C52.1 R42.2 62.11,57.67 62.36,57.91 C41.1
AOUT4L
  Top 0.203: R43.2 C53.1 61.07,53.33 C40.1
AOUT4R
  Top 0.203: R44.2 C54.1 62.24,49.91 C39.1
APDN  (via drill 0.3)
  Top 0.203: U7.10 32.79,49.05 30.95,47.2 27.36,47.2 v27.3,47.14 | v26.67,43.18 29.21,43.18 J13.9
  Top 0.254: U3.70 30.17,11.25 29.97,11.05 v29.94,11.05
  Bottom 0.203: J13.9 30.3,40.64 29.72,40.06 29.72,32.77 30.48,32 30.48,26.79 29.57,25.87 29.57,24.8 29.36,24.59 29.36,21.16 29.59,20.93 29.59,20.14 29.38,19.93 29.38,11.62 v29.94,11.05 | v27.3,47.14 v27.29,47.14 26.67,46.52 v26.67,43.18
BCLK  (via drill 0.3)
  Top 0.203: U7.21 39.35,45.22 v39.23,45.1 38.75,45.1 J13.6 | v37.36,45.25 U7.17
  Top 0.254: U3.11 27.67,30.51 27.82,30.66 v27.81,30.67
  Bottom 0.203: v39.23,45.1 37.51,45.1 v37.36,45.25 | v27.81,30.67 27.57,30.91 27.57,42.05 31.19,45.66 34.35,45.66 J13.6
BLUE_LED  (via drill 0.3)
  Top 0.203: v17.27,23.37 17.72,23.82 U3.31
  Top 0.254: R54.1 11.93,50.6 12.17,50.37 12.17,49.71 11.71,49.25 v10.69,49.25
  Bottom 0.203: v10.69,49.25 10.92,49.02 10.92,46.99 10.67,46.74 10.67,28.69 15.99,23.37 v17.27,23.37
CC1
  Top 0.254: J16.A5 7.6,22.33 8,22.73 8,23.37 8.38,23.75 R50.2
CC2
  Top 0.254: R49.2 7.75,20.07 7.02,19.33 J16.B5
CM_1.5V
  Top 0.203: U7.38 40.35,55.79 41.23,56.67 41.23,58.08 42.36,59.21 46.74,59.21 47.98,57.96 47.98,57.15 | 47.98,57.15 47.98,56.54 48.41,56.11 51.44,56.11 | 53.98,56.11 U4.3 | 51.44,56.11 53.98,56.11 | U4.5 51.44,56.11 | U4.12 53.98,53.31 | 53.98,53.31 53.98,56.11 | U4.10 51.44,52.83 51.92,53.31 53.98,53.31 | C55.1 46.95,57.15 47.98,57.15
DBUG  (via drill 0.3)
  Top 0.254: v31.54,11.09 31.17,11.46 U3.72
  Bottom 0.203: J3.1 32.65,12.19 v31.54,11.09
DGND  (via drill 0.3)
  Top 0.203: U7.12 33.85,47.13 C36.2 | U7.25 43.26,48.05 43.56,47.75 v43.56,46.61
  Top 0.508: J16.GND 7.04,24.31 | J16.GND2 6.88,17.86
  other vias: 7.37,0.76 0.76,6.6 39.12,0.76 43.69,0.76 14.22,53.09 19.56,59.18 14.22,49.53 13.97,43.18 18.19,41.94 0.76,67.06 20.32,54.61 74.17,40.13 28.07,66.29 28.07,72.9 7.62,72.9 0.76,68.83 74.17,34.54 74.17,27.18 74.17,14.99 74.17,8.64 30.73,39.37 17.81,46.06 0.76,47.24 74.17,0.76 64.26,0.76 0.76,0.76 0.76,39.12 0.76,33.02 4.32,37.34 0.76,42.93 13.97,44.45 13.97,45.72 13.97,41.91 13.97,40.64 11.94,30.48 8.38,4.06 72.39,30.48 72.14,22.86 5.54,49.38 7.37,49.02 6.86,45.97 17.02,10.67 17.53,8.13 45.72,20.32 42.01,16.47 38.5,13.07 27.84,5.47 28.07,57.4 28.19,52.83 0.76,72.9 0.76,57.4 0.76,55.88 7.37,56.39 11.91,56.57 14.73,57.66 0.76,29.21 0.76,26.92 34.04,0.76 28.7,0.76 48.16,0.76 25.15,9.65 18.8,13.46 17.53,6.1 56.64,0.76 61.59,10.99 65.79,17.53 63.63,24.43 54.1,24.38 45.97,23.62 19.3,32.26 15.49,37.08 15.66,24.83 10.03,18.16 9.65,16 41.27,19.05 0.76,50.29 0.76,11.43 0.76,14.73 31.22,9.3 27.39,13.87 47.62,28.32 28.19,54.74 28.07,49.66 31.88,46.61 43.69,44.7 43.69,41.53 43.56,38.1 44.83,33.91 48.64,32.64 53.59,32.64 58.29,32.64 63.75,33.53 65.15,38.1 65.66,42.93 69.85,43.56 74.3,43.43 41.44,29.84 38.85,32.39 36.38,38.51 32.57,38.57 28,23.64 20.97,24.06 21.58,14.18 29.61,26.78 31.74,26.93 27.98,26.84 29.74,29.51 33.08,30.29 36.1,30.9 32.55,24.04 29.99,22.55 28.41,9.61 42.5,6.55 41.38,4.96 43.48,12.23 38.67,17.15 44.22,15.26 36.09,11.91 20.61,3.01 11.15,4.94 7.81,17.58 7.8,16.65 7.58,24.35 7.56,25.47 45.73,7.85 48.26,11.14 24.81,34.71 25.52,40.52 9.94,12.96 12.24,10.56 15.02,13.99 11.59,15.26 40.81,7.91 38.66,10.37 23.06,40.05 18.5,39.3 23.25,42.76
  pour Top (isolate 0.178, rank 3): 0,73.66 28.57,73.66 28.57,46.99 43.94,46.99 43.94,35.26 46.18,33.02 62.52,33.02 64.77,35.27 64.77,42.55 66.04,43.81 74.93,43.81 74.93,0 0,0
  pour Bottom (isolate 0.178, rank 2): 0,73.66 28.57,73.66 28.57,46.99 43.94,46.99 43.94,35.25 46.17,33.02 62.5,33.02 64.77,35.29 64.77,42.55 66.04,43.81 74.93,43.81 74.93,0 0,0
GREEN_LED  (via drill 0.3)
  Top 0.203: U3.27 17.74,25.82 17.14,26.42 15.16,26.42 14.43,27.15 v14.02,27.15
  Top 0.254: v12.14,53.39 11.99,53.54 R53.1
  Bottom 0.203: v14.02,27.15 14.57,27.7 14.57,33.95 11.86,36.65 11.86,53.11 v12.14,53.39
I2C_SCK  (via drill 0.3)
  Top 0.203: J4.4 45.65,6.1 | 45.65,6.1 45.65,6.68 44.42,7.9 R52.1 | v46.27,6.1 45.65,6.1 | U3.55 22.67,11.24 22.24,10.81 21.25,10.81 19.95,9.5 19.95,5.79 20.91,4.83 26.92,4.83 TP1.1
  Bottom 0.203: v46.27,6.1 41.95,1.78 29.97,1.78 TP1.1
I2C_SDA  (via drill 0.3)
  Top 0.203: J4.3 v44.65,6.07 44.65,6.66 43.34,7.97 R51.1 | U3.64 27.17,11.47 26.92,11.22 26.92,8.31 29.56,5.68 29.56,4.43 31.45,2.54 TP2.1
  Bottom 0.203: v44.65,6.07 40.77,2.19 32.09,2.19 TP2.1
LF
  Top 0.203: C35.1 C34.1 36.27,56.26 35.85,55.84 U7.47
LRCK  (via drill 0.3)
  Top 0.203: J13.5 38.12,41.92 38.12,43.65 38.87,44.4 39.46,44.4 39.84,44.78 39.84,45.2 39.85,45.2 U7.22 39.85,47.4 39.66,47.59 38.11,47.59 37.85,47.33 U7.18
  Top 0.254: U3.12 27.17,30.93 27.71,31.47 v28.2,31.47
  Bottom 0.203: v28.2,31.47 27.96,31.7 27.96,41.84 31.41,45.28 33.91,45.28 35.6,43.6 35.6,41.87 J13.5
MCLK  (via drill 0.3)
  Top 0.254: U3.15 25.67,29.69 v26.31,30.33 | U7.2 30.36,53.05 29.69,53.72 25.78,53.72 TP4.1
  Bottom 0.203: v26.31,30.33 v26.32,30.33 26.57,30.58 26.57,42.3 25.4,43.46 TP4.1
MIDI-IN-PIN4  (via drill 0.3)
  Top 0.254: v20.12,67.73 20.27,67.73 22.1,65.9 R45.1
  Bottom 0.254: v20.12,67.73 19.9,67.73 J15.1
MIDI-IN-PIN5
  Top 0.254: 14.73,63.75 14.73,62.48 15.24,61.98 16.76,61.98 17.17,61.57 U6.3 | 14.73,63.75 14.73,65.28 17.78,68.33 J15.2 | D3.A 14.73,63.75
MIDI-OUT-PIN4
  Top 0.254: R47.1 24.13,67.31 20.32,71.12 J15.3
MIDI-OUT-PIN5
  Top 0.254: R46.2 26.16,69.09 25.4,69.85 J15.5
MIN  (via drill 0.3)
  Top 0.203: v27.64,17.2 27.76,17.2 28.48,16.48 31.95,16.48 32.95,15.48 32.95,14.44 32.67,14.15 U3.75 | v29.46,40.89 29.05,41.3 21.59,41.3 19.47,43.42 R48.1 17.86,48.51 17.24,49.14 U6.6
  Bottom 0.203: v27.64,17.2 27.35,17.49 27.35,28.14 29.7,30.49 29.7,32.02 29.21,32.51 29.21,40.64 v29.46,40.89
MOUT  (via drill 0.3)
  Top 0.254: U3.56 23.17,13.27 v23.63,13.73 | U8.2 v26.42,57.4
  Bottom 0.203: v23.63,13.73 23.88,13.98 23.88,19.3 23.11,20.07 23.11,23.37 20.18,26.3 20.18,51.17 v26.42,57.4
N$1
  Top 0.203: U3.98 39.96,25.32 40.52,24.76 Y1.1 40.52,21.82 40.23,21.53 C7.1
N$2
  Top 0.203: U3.99 38.01,25.82 38.22,26.03 Y1.3 38.19,27.28 C9.1
N$3  (via drill 0.3)
  Top 0.203: v35.88,24.05 35.61,24.32 U3.96 | v37.31,32.9 37.28,32.93 C19.1 35.74,32.93 35.43,33.24 FB1.1
  Bottom 0.203: v37.31,32.9 37.31,27.81 36.47,26.97 36.47,25.19 35.88,24.6 v35.88,24.05
N$4
  Top 0.203: L1.2 42.28,21.82 C14.1
  Top 0.254: U3.90 37.1,21.32 38.1,20.32 L1.2
N$5  (via drill 0.3)
  Top 0.203: U3.86 33.68,19.32 33.49,19.51 33.49,20 v33.29,20.21 | v36.66,33.74 35.88,34.51 C23.1 32.91,33.33 FB2.1
  Bottom 0.203: v33.29,20.21 32.99,20.21 32.7,20.5 32.7,22.36 33.49,23.16 34.79,23.16 35.28,23.64 35.28,24.55 36.06,25.33 36.06,27.1 36.92,27.96 36.92,32.39 36.66,32.66 v36.66,33.74
N$6  (via drill 0.3)
  Top 0.203: C33.2 R14.2 48.9,50.68 U4.8 48.9,54.73 v48.95,54.78 | C69.2 39.62,59.01 41.01,60.4 47.81,60.4 48.12,60.71 R60.1 49.01,60.72 v49.01,61.52
  Bottom 0.203: v48.95,54.78 48.95,61.45 v49.01,61.52
N$7  (via drill 0.3)
  Top 0.254: v40.28,10.41 43.03,10.41 43.34,10.11 R51.2
  Bottom 0.203: I2C.3 40.11,10.58 v40.28,10.41
N$8  (via drill 0.3)
  Top 0.203: U3.30 16.7,24.32 v16.51,24.13
  Bottom 0.203: v16.51,24.13 J8.1
N$9  (via drill 0.3)
  Top 0.254: v43.07,11.34 43.07,11.28 44.42,9.92 R52.2
  Bottom 0.254: v43.07,11.34 42.85,11.55 I2C.1
N$11
  Top 0.203: C34.2 36.27,59.41 36.06,59.62 R5.2
N$12
  Top 0.203: R15.1 C63.1
N$14
  Top 0.203: U4.7 48.9,58.54 R59.2 C61.2 41.14,59.69 40.64,59.19 C70.2
N$15
  Top 0.203: U4.1 56.38,57.55 R63.2 C68.2 56.78,59.69 56.97,59.88 56.97,61.91 56.53,62.35 55.06,62.35 54.81,62.6 48.98,62.6 47.19,60.81 40.47,60.81 38.61,58.94 C72.2
N$16  (via drill 0.3)
  Top 0.203: U3.97 36.42,24.82 v37.16,24.09 | R17.2 41.78,25.28 v41.66,25.4
  Top 0.254: C20.1 43.6,25.3 R17.2
  Bottom 0.203: v37.16,24.09 38.47,25.4 v41.66,25.4
N$17  (via drill 0.3)
  Top 0.203: v23.62,37.08 22.94,36.4 C26.1 FB3.2
  Top 0.254: U3.9 28.67,27.21 28.7,27.18 28.7,26.52 27.84,25.65 v25.15,25.65
  Bottom 0.203: v25.15,25.65 23.62,27.18 v23.62,37.08
N$18
  Top 0.203: J14.15 67.31,52.07 67.07,51.83 C39.2
N$19
  Top 0.203: J14.13 66.04,54.61 65.52,55.13 C40.2
N$20
  Top 0.203: J14.11 66.04,57.15 65.65,56.76 C41.2
N$21
  Top 0.203: R41.2 60.97,60.98 60.97,62.07 C51.1 62.15,62.06 C42.1
N$22
  Top 0.203: J14.7 65.52,65.29 C43.2
N$23
  Top 0.203: R37.1 C75.2 R25.2
N$24
  Top 0.254: L1.1 44.2,20.32 44.2,19.3 43.94,19.05 42.67,19.05 42.42,18.8 42.42,17.78 R16.2
N$25
  Top 0.203: R11.1 R7.2 50.38,42.84 U5.1
N$26
  Top 0.254: S2.2 2.58,8.68 3.56,9.65 12.19,9.65 | R1.1 12.19,9.65 | S1.3 12.06,9.53 12.19,9.65
N$27
  Top 0.203: R44.1 C74.2 R65.2
N$28
  Top 0.203: R43.1 C73.2 R58.2
N$29
  Top 0.61: R12.1 R8.2 50.41,20.26 U1.1
N$30
  Top 0.203: R42.1 60.58,58.67 C80.2 R57.2
N$31
  Top 0.203: R39.2 C49.1 54.36,66.05 54.48,66.17 54.48,66.67 54.61,66.8 C44.1
N$32
  Top 0.203: C46.2 58.67,71.37 59.44,72.14 66.04,72.14 66.29,72.14 J14.1
N$33
  Top 0.203: C45.2 58.67,68.83 59.82,67.69 68.2,67.69 J14.3
N$34  (via drill 0.3)
  Top 0.406: J4.2 43.65,6.97 42.91,7.7 42.88,7.7 42.42,8.16 v42.42,8.28
  Bottom 0.406: 3V3_QWIIC.2 42.48,8.34 v42.42,8.28
N$35
  Top 0.254: D4.2 7.02,52.8 7.77,53.54 R53.2
N$36
  Top 0.254: R54.2 4.13,50.6 3.79,50.95 3.79,52.32 3.31,52.8 D4.3
N$37
  Top 0.254: D4.1 7.07,51.34 7.8,52.07 R55.2
N$38
  Top 0.254: U8.4 27.97,61.24 28.19,61.47 28.19,62.48 27.52,63.16 R46.1
N$45
  Top 0.203: C3.1 50.01,37.85 U5.3
  Top 0.508: FB5.2 49.98,37.82 50.01,37.85
N$48
  Top 0.203: U7.35 43.07,53.05 43.36,53.34 43.36,53.7 43.61,53.95 C56.1
N$49
  Top 0.203: U4.6 50.03,57.55 R59.1 C61.1 R60.2
N$51
  Top 0.203: U4.9 50.16,50.68 R14.1 C33.1 R15.2
N$52
  Top 0.203: R56.2 59.86,61.05 R41.1 C79.2
N$53
  Top 0.203: R40.1 C78.2 R28.2
N$54
  Top 0.203: R38.1 C76.2 R26.2
N$55
  Top 0.203: R39.1 C77.2 R27.2
N$56  (via drill 0.3)
  Top 0.203: C67.2 R61.2 56.52,50.68 U4.14 56.52,54.93 v56.5,54.94 | v56.34,61.61 56.38,61.57 R64.1 | C71.2 37.59,59.05 39.73,61.19 47.03,61.19 48.82,62.98 v55.37,62.98
  Bottom 0.203: v56.5,54.94 56.5,61.45 v56.34,61.61 56.34,62.01 v55.37,62.98
N$58
  Top 0.203: R62.1 C66.1
N$59
  Top 0.203: U4.2 55.24,58.54 R63.1 C68.1 R64.2
N$60
  Top 0.203: U4.13 55.24,50.68 R61.1 | R61.1 C67.1 | R61.1 R62.2
N$75
  Top 0.254: R2.2 55.62,12.7 54.84,11.92 Q1.1
NRESET  (via drill 0.3)
  Top 0.203: U3.58 24.17,6.9 v24.13,6.86 24.39,6.6 R10.1 | R1.2 15.84,11.11 | 15.84,11.11 15.84,12.06 15.61,12.28 R3.1 | C1.1 15.83,11.12 15.84,11.11
  Top 0.254: R1.2 15.84,8.29 TP9.1
  Bottom 0.203: TP9.1 17.27,6.86 v24.13,6.86 25.67,6.86 26.18,6.35 32.44,6.35 33.94,4.85 39.75,4.85 40.22,5.31 40.22,6.16 39.39,6.99 J9.10
OL1  (via drill 0.3)
  Top 0.203: v37.69,53.91 37.83,53.91 39.81,51.93 39.81,50.85 41.1,49.55 U7.28 | v49.84,71.01 R25.1
  Bottom 0.203: v37.69,53.91 37.69,63.71 44.99,71.01 v49.84,71.01
OL2  (via drill 0.3)
  Top 0.203: U7.30 41.24,50.55 40.61,51.18 40.61,52.54 39.56,53.58 39.57,53.58 v39.57,53.93 | R27.1 50.39,66.05 v49.85,66.59
  Bottom 0.203: v39.57,53.93 39.57,54.82 38.6,55.79 38.6,63.27 41.93,66.6 v49.84,66.6 v49.85,66.59
OL3  (via drill 0.3)
  Top 0.203: U7.6 34.65,51.05 35.77,52.17 35.77,52.86 36.77,53.85 v36.77,53.89 | R56.1 58.94,62.62 v59.2,62.88
  Bottom 0.203: v59.2,62.88 59.16,62.92 59.16,63.56 57.2,65.51 42.16,65.51 39.6,62.95 39.6,56.13 41.14,54.59 41.14,53.65 40.62,53.12 37.53,53.12 v36.77,53.89
OL4  (via drill 0.3)
  Top 0.203: U7.8 34.77,50.05 36.76,52.04 v36.76,52.11 | v58.97,53.38 58.93,53.42 R58.1
  Bottom 0.203: v36.76,52.11 36.91,52.26 41.01,52.26 41.95,53.2 41.95,54.92 40.51,56.36 40.51,62.58 42.64,64.71 56.88,64.71 58.18,63.41 58.18,54.17 v58.97,53.38
OR1  (via drill 0.3)
  Top 0.203: U7.29 41.16,50.05 40.23,50.98 40.23,52.05 38.68,53.6 v38.68,53.93 | v49.84,68.4 50.74,68.4 R26.1
  Bottom 0.203: v38.68,53.93 38.18,54.44 38.18,63.54 43.04,68.4 v49.84,68.4
OR2  (via drill 0.3)
  Top 0.203: U7.31 41.29,51.05 40.99,51.35 40.99,52.9 40.47,53.42 v40.47,53.95 v40.46,53.95 | R28.1 58.41,64.4 58.06,64.75 v58.06,65.66
  Bottom 0.203: v40.46,53.95 40.46,54.56 39.07,55.96 39.07,63.1 41.92,65.95 57.77,65.95 v58.06,65.66
OR3  (via drill 0.3)
  Top 0.203: U7.7 34.72,50.55 36.15,51.99 36.15,52.36 36.76,52.98 v36.76,52.99 | v58.88,56.54 58.88,57.62 R57.1
  Bottom 0.203: v36.76,52.99 37.05,52.7 40.83,52.7 41.52,53.39 41.52,54.75 40.03,56.24 40.03,62.71 42.43,65.11 57.04,65.11 58.59,63.57 58.59,56.84 v58.88,56.54
OR4  (via drill 0.3)
  Top 0.203: R65.1 58.28,50.94 58.04,51.18 v58.04,51.69 | v38.05,51.64 37.26,51.64 35.18,49.55 U7.9
  Bottom 0.203: v38.05,51.64 38.23,51.81 41.17,51.81 42.34,52.98 42.34,55.17 41,56.52 41,62.39 42.89,64.28 56.73,64.28 57.8,63.22 57.8,53.7 58.04,53.45 v58.04,51.69
RED_LED  (via drill 0.3)
  Top 0.203: U3.25 20.67,29.27 20.45,29.49 18.75,29.49
  Top 0.254: 18.75,29.49 v18.68,29.56 | R55.1 12.62,52.07 v12.65,52.05
  Bottom 0.203: v18.68,29.56 15.07,33.16 15.07,34.1 12.37,36.8 12.37,51.77 v12.65,52.05
REGINPUTS  (via drill 0.3)
  Top 0.508: v49.98,31.66 FB5.1
  Bottom 0.508: v52.09,13.17 52.12,13.15 v53.01,13.15 61.74,13.15 63.14,14.55 63.14,23.47 54.94,31.66 v49.98,31.66
  pour Top (isolate 0.203): 47.07,15.33 53.34,15.33 53.34,11.43 48.93,11.43 47.07,13.29
RXD  (via drill 0.3)
  Top 0.203: U3.51 20.67,10.81 19.55,9.69 19.55,5.85 17.52,3.81 v15.24,3.81
  Bottom 0.203: J18.3 v15.24,3.81
SDCD  (via drill 0.3)
  Top 0.203: R18.1 4.61,33.15 v5.08,32.68 | U3.49 17.81,14.82 17.23,15.4 13.18,15.4 v11.56,17.02
  Top 0.254: JP7.CD1 JP7.CD2 15.98,41.4 15.98,39.35 14.48,37.85 v6.86,37.85
  Bottom 0.203: v6.86,37.85 7.11,37.59 7.11,36.07 6.6,35.56 6.6,32.64 | 6.6,32.64 6.6,28.77 9.14,26.23 9.14,20.64 10.92,18.86 10.92,17.65 v11.56,17.02 | v5.08,32.68 5.12,32.64 6.6,32.64
SDCLK  (via drill 0.3)
  Top 0.203: U3.40 17.03,19.32 16.26,18.54 13.46,18.54 11.43,20.57 v11.43,21.34
  Top 0.254: JP7.SCLK 8.35,44.74 v8.38,44.7
  Bottom 0.203: v8.38,44.7 9.14,43.94 9.14,35.05 8.64,34.54 8.64,32.16 9.14,31.65 9.14,28.48 11.43,26.19 v11.43,21.34
SDCMD  (via drill 0.3)
  Top 0.203: v20.88,17.88 21.31,18.32 27.99,18.32 29.02,17.28 32.27,17.28 33.73,15.82 U3.79 | v8.46,31.03 8.42,31.06 5.75,31.06 4.41,29.72 R23.1
  Top 0.254: JP7.DI v8.01,42.54
  Bottom 0.203: v8.01,42.54 8.64,41.91 8.64,35.31 8.13,34.8 8.13,31.92 8.64,31.41 8.64,31.03 | 8.64,31.03 8.64,30.47 8.64,28.41 10.67,26.38 10.67,21.18 13.28,18.56 19.62,18.56 20.3,17.88 v20.88,17.88 | v8.46,31.03 8.64,31.03
SDD0  (via drill 0.3)
  Top 0.203: U3.82 32.83,17.32 32.46,17.68 29.16,17.68 28.13,18.72 20.56,18.72 v20.55,18.74 | R21.1 4.31,30.86 5.12,31.66 8.93,31.66 v9.51,32.23
  Top 0.254: JP7.DO 7.82,46.94 v7.87,46.99
  Bottom 0.203: v7.87,46.99 9.14,46.99 9.65,46.48 9.65,34.8 9.14,34.29 9.14,33.8 9.65,33.29 9.65,32.23 | 9.65,32.23 9.65,28.57 12.19,26.03 12.19,20.32 13.44,19.07 19.8,19.07 20.14,18.74 v20.55,18.74 | v9.51,32.23 9.65,32.23
SDD1  (via drill 0.3)
  Top 0.203: U3.83 32.88,17.82 32.63,18.07 29.37,18.07 28.31,19.13 21.77,19.13 21.34,19.56 v20.31,19.56 | v9.9,34.09 9.9,33.54 8.41,32.06 4.43,32.06 4.37,32 R22.1
  Top 0.254: JP7.RSV2 9.62,48.04 v10.16,47.5
  Bottom 0.203: v10.16,47.5 10.16,34.09 | 10.16,34.09 10.16,28.63 12.7,26.09 12.7,20.57 13.72,19.55 v20.31,19.55 | v9.9,34.09 10.16,34.09
  Bottom 0.254: v20.31,19.56 v20.31,19.55
SDD2  (via drill 0.3)
  Top 0.203: U3.42 16.8,18.32 16.51,18.03 11.94,18.03 v11.68,18.29 | v7.34,29.62 7.1,29.86 6.69,29.86 4.27,27.43 R19.1
  Top 0.254: JP7.RSV1 6.91,40.34 v7.37,39.88
  Bottom 0.203: v7.37,39.88 7.62,39.62 7.62,35.81 7.11,35.31 7.11,29.62 | 7.11,29.62 7.11,28.81 9.65,26.27 9.65,20.86 11.68,18.82 v11.68,18.29 | v7.34,29.62 7.12,29.62 7.11,29.62
SDD3  (via drill 0.3)
  Top 0.203: v7.92,30.32 7.72,30.5 6.16,30.5 4.23,28.57 R20.1 | U3.50 17.01,14.32 v16.68,14.65
  Top 0.254: JP7.CS 7.59,41.44 v7.87,41.15
  Bottom 0.203: v7.87,41.15 8.13,40.89 8.13,35.56 7.62,35.05 7.62,30.61 v7.92,30.32 8.13,30.1 8.13,28.36 10.16,26.33 10.16,21.04 16.55,14.65 v16.68,14.65
SHIELD  (via drill 0.3)
  other vias: 1.27,23.88 1.27,17.78
  pour Top (isolate 0.305): 0,16.13 6.35,16.13 6.35,25.53 0,25.53
  pour Bottom (isolate 0.305): 6.35,16.13 0,16.13 0,25.53 6.35,25.53
SPI0_CIPO  (via drill 0.3)
  Top 0.203: U3.45 19.81,16.82 21.17,15.46 26.73,15.46 27.3,14.89 29.56,14.89 v30.62,13.82 | U7.24 40.85,45.12 40.61,44.88 40.61,41.88 J13.3
  Bottom 0.203: J13.3 39.37,38.1 38.22,36.96 35.96,36.96 33.81,34.82 33.81,28.12 30.62,24.93 v30.62,13.82
SPI0_COPI  (via drill 0.3)
  Top 0.203: U3.43 19.68,17.82 19.85,17.65 19.85,17.32 21.33,15.84 26.89,15.84 27.46,15.27 30.04,15.27 v31.49,13.81 v31.5,13.81 | U7.23 40.35,45.16 40.23,45.04 40.23,44.04 J13.4
  Bottom 0.203: v31.5,13.81 31.02,14.29 31.02,24.74 34.29,28 34.29,34.67 36.2,36.58 38.47,36.58 40.59,38.69 40.59,41.96 J13.4
SPI0_NPCS1  (via drill 0.3)
  Top 0.203: U7.27 41.3,49.05 40.77,48.51 40.77,47.75 41.91,46.61 J13.2 | v20.8,22 20.62,21.82 U3.35 18.75,21.8 R4.1 | v21.51,17.09 21.95,16.64 27.16,16.64 27.78,16.03 31.54,16.03 v32.27,15.3
  Bottom 0.203: v21.51,17.09 v21.52,17.1 21.52,21.28 v20.8,22 | v32.27,15.3 31.8,15.77 31.8,24.33 35.09,27.62 35.09,34.26 36.6,35.76 38.89,35.76 43.13,40 43.13,41.15 41.91,42.36 J13.2
SPI0_SPCK  (via drill 0.3)
  Top 0.203: U7.26 41.44,48.55 41.27,48.39 41.27,47.78 42.29,46.77 42.29,44.7 43.15,43.84 43.15,41.88 J13.1 | U3.41 19.59,18.82 20.23,18.18 20.23,17.48 21.49,16.22 27.05,16.22 27.62,15.65 30.85,15.65 v32.03,14.46
  Bottom 0.203: v32.03,14.46 31.4,15.09 31.4,24.51 34.67,27.78 34.67,34.51 36.36,36.2 38.72,36.2 41.91,39.39 J13.1
SWCLK/TCK  (via drill 0.3)
  Top 0.203: U3.63 26.67,11.54 25.86,10.73 v24.99,10.73
  Top 0.254: R9.1 v22.86,8.38 22.86,9.65 v23.37,10.16
  Bottom 0.203: v22.86,8.38 23.11,8.13 26.16,8.13 TP6.1 | TP6.1 26.85,7.8 34.87,7.8 35.56,7.11 J9.4 | v24.99,10.73 23.94,10.73 v23.37,10.16
  Bottom 0.254: TP6.1
SWDIO/TMS  (via drill 0.3)
  Top 0.254: R6.1 v21.34,8.13 21.34,9.91 TP5.1 22.35,10.16 23.67,11.48 U3.57
  Bottom 0.203: v21.34,8.13 21.84,7.62 25.63,7.62 26.39,6.86 34.04,6.86 34.16,6.99 J9.2
TDI
  Top 0.203: U3.74 32.17,11.01 TP8.1 35.56,10.16 36.24,10.84 37.13,10.84 37.51,10.46 37.51,7.62 37.51,7.57 J9.8
TDMI  (via drill 0.3)
  Top 0.203: U7.20 38.85,45.82 37.48,44.45 35.93,44.45 35.57,44.1 35.57,41.92 J13.7 | v25.81,14.81 25.55,15.08 21.02,15.08 19.77,16.32 U3.46
  Bottom 0.203: v25.81,14.81 25.91,14.91 25.91,20.57 26.92,21.59 26.92,28.3 29.26,30.63 29.26,31.89 28.8,32.34 28.8,41.27 29.49,41.96 32.97,41.96 J13.7
TDMO  (via drill 0.3)
  Top 0.203: U7.16 36.85,45.65 36.04,44.83 35.77,44.83 35.19,44.26 35.19,44.08 J13.8
  Top 0.254: U3.36 21.15,21.32 21.67,21.84 v26.16,21.84
  Bottom 0.203: v26.16,21.84 26.16,28.1 28.85,30.79 28.85,31.69 28.4,32.15 28.4,41.67 31.59,44.86 32.78,44.86 34.29,43.35 J13.8
TDO  (via drill 0.3)
  Top 0.203: v37.4,14.38 36.96,14.82 U3.77 | J9.6 TP7.1
  Bottom 0.203: v37.4,14.38 36.83,13.8 TP7.1
TXD  (via drill 0.3)
  Top 0.203: v20,11.94 20,10.77 19.16,9.93 19.16,6.06 17.58,4.47 14.67,4.47 v13.96,3.77 | v21.46,26.89 21.66,27.09 U3.23
  Bottom 0.203: v20,11.94 20.97,12.91 23.81,12.91 24.46,13.56 24.46,19.53 23.65,20.34 23.65,23.6 21.45,25.8 21.45,26.87 v21.46,26.89 | v13.96,3.77 13.96,2.54 J18.2
UIA1  (via drill 0.3)
  Top 0.203: U3.17 24.67,30.77 v25.4,31.5 | v25.55,35.68 25.81,35.94 37.35,35.94 43.98,29.31 64.45,29.31 66.46,31.32 66.46,32.17 J10.7
  Bottom 0.203: v25.55,35.68 25.55,31.64 v25.4,31.5
UIA2  (via drill 0.3)
  Top 0.203: J10.5 67.22,35.47 67.22,33.47 66.08,32.32 66.08,31.47 64.29,29.69 44.19,29.69 37.5,36.38 25.81,36.38 v25.54,36.66
  Top 0.254: U3.20 23.17,30.17 v22.86,30.48
  Bottom 0.203: v22.86,30.48 22.86,37.69 23.33,38.16 24.94,38.16 25.54,37.57 v25.54,36.66
UIA3  (via drill 0.3)
  Top 0.203: J10.3 66.83,37.62 66.83,33.62 65.69,32.48 65.69,31.63 64.13,30.07 44.36,30.07 37.59,36.84 26.33,36.84 25.8,37.37 25.8,38.21 v25.44,38.56
  Top 0.254: U3.21 22.67,27.11 v22.86,26.92
  Bottom 0.203: v22.86,26.92 22.23,27.55 22.23,37.64 23.16,38.56 v25.44,38.56
UIA4  (via drill 0.3)
  Top 0.203: J10.1 66.45,39.78 66.45,33.78 65.31,32.64 65.31,31.79 63.97,30.45 44.55,30.45 37.78,37.22 26.49,37.22 26.18,37.53 26.18,38.86 v25.45,39.59
  Top 0.254: U3.16 25.17,30.31 v25.44,30.59
  Bottom 0.203: v25.44,30.59 26.16,31.3 26.16,39.06 25.63,39.59 v25.45,39.59
UID1  (via drill 0.3)
  Top 0.203: v48.64,7.24 48.64,5.95 46.31,3.62 34.48,3.62 33.28,4.82 31,4.82 27.33,8.48 27.33,11.04 27.67,11.38 U3.65
  Bottom 0.203: J11.15 65.02,7.37 48.77,7.37 v48.64,7.24
UID2  (via drill 0.3)
  Top 0.203: v28.45,14.22 28.96,14.22 29.67,13.51 U3.69 | v47.76,7.41 v47.75,7.4 47.75,5.64 46.14,4.02 34.84,4.02 33.57,5.29 31.29,5.29 27.79,8.79 27.79,10.47 v27.96,10.65
  Bottom 0.203: J11.13 67.03,7.9 48.02,7.9 47.76,7.63 v47.76,7.41 | v28.45,14.22 28.45,11.13 v27.96,10.65
UID3  (via drill 0.3)
  Top 0.203: U3.78 35.48,15.32 39.77,15.32 41.05,14.04 42.64,14.04 46.15,10.53 46.15,9 46.43,8.72 v46.43,8.65
  Bottom 0.203: J11.11 68.07,8.38 46.7,8.38 v46.43,8.65
  Bottom 0.254: J11.11
UID4  (via drill 0.3)
  Top 0.203: v46.91,9.39 v46.9,9.39 46.62,9.67 46.62,10.6 42.8,14.42 41.21,14.42 39.31,16.32 U3.80
  Bottom 0.203: J11.9 66.04,8.89 47.38,8.89 46.91,9.36 v46.91,9.39
UID5  (via drill 0.3)
  Top 0.203: U3.84 36.1,18.32 36.4,18.62 39.75,18.62 40.3,18.06 40.3,15.86 41.36,14.8 42.96,14.8 47.23,10.53 v47.23,10.18
  Bottom 0.203: J11.7 64.01,9.4 47.89,9.4 47.23,10.05 v47.23,10.18
UID6  (via drill 0.3)
  Top 0.203: U3.85 35.84,18.82 36.07,19.05 39.88,19.05 40.75,18.18 40.75,15.96 41.52,15.18 43.11,15.18 48.13,10.17 v48.13,10.12
  Bottom 0.203: J11.5 61.98,9.91 48.34,9.91 v48.13,10.12
UID7  (via drill 0.3)
  Top 0.203: U3.87 35.55,19.82 35.56,19.81 v37.34,19.81
  Top 0.254: J11.3 67.82,19.05 66.8,20.07 66.8,24.38 65.79,25.4 52.58,25.4 v52.32,25.15
  Bottom 0.203: v37.34,19.81 37.34,21.65 39.15,23.47 42.39,23.47 43.65,24.73 51.91,24.73 v52.32,25.15
UID8  (via drill 0.3)
  Top 0.203: v36.58,20.57 36.32,20.32 U3.88
  Top 0.254: J11.1 67.31,22.86 67.31,24.64 66.04,25.91 51.82,25.91 v51.56,25.65
  Bottom 0.203: v36.58,20.57 36.58,21.49 38.99,23.91 42.23,23.91 43.47,25.15 51.05,25.15 v51.56,25.65
UID9  (via drill 0.3)
  Top 0.203: U3.89 33.79,20.82 33.78,20.83 33.6,20.83 v33.31,21.12
  Top 0.254: J10.15 66.29,26.42 51.18,26.42 v50.8,26.04
  Bottom 0.203: v50.8,26.04 50.32,25.56 43.31,25.56 42.09,24.34 38.84,24.34 36.47,21.97 34.15,21.97 v33.31,21.12
UID10  (via drill 0.3)
  Top 0.203: v33.33,22.07 33.57,21.82 U3.91
  Top 0.254: J10.13 66.8,26.67 66.55,26.92 50.55,26.92 v50.04,26.42
  Bottom 0.203: v33.33,22.07 33.74,22.48 36.42,22.48 38.7,24.77 41.95,24.77 43.16,25.97 49.59,25.97 v50.04,26.42
UID11  (via drill 0.3)
  Top 0.254: v49.28,26.92 49.78,27.43 65.02,27.43 66.8,29.21 J10.11 | U3.92 35.5,22.32 36.04,22.86 v36.04,23.15
  Bottom 0.203: v36.04,23.15 36.52,23.63 36.52,24.33 38.54,26.35 48.7,26.35 v49.28,26.92
UID12  (via drill 0.3)
  Top 0.203: U3.1 35.53,28.22 v37.08,26.67
  Top 0.254: J10.9 64.77,27.94 49.15,27.94 v48.51,27.3
  Bottom 0.203: 37.1,26.67 37.19,26.76 47.97,26.76 v48.51,27.3
  Bottom 0.254: 37.1,26.67 v37.08,26.67
USERSW  (via drill 0.3)
  Top 0.203: U3.26 17.88,26.32 17.35,26.85 15.34,26.85 v13.11,29.08
  Top 0.254: S3.3 12.06,60.07 11.18,60.96 4.28,60.96 S4.2
  Bottom 0.203: v13.11,29.08 12.37,29.08 11.18,30.28 11.18,46.48 11.43,46.74 11.43,49.53
  Bottom 0.254: S4.2 2.54,58.42 11.43,49.53
V_USB  (via drill 0.3)
  Top 0.406: v30.89,4.13 33.15,4.13 34.16,3.12 46.52,3.12 49.52,6.12 C2.1 49.52,8.51 D1.A
  Top 0.508: J16.VBUS1 6.8,23.53 v7.11,23.22 | v7.06,18.66 6.04,18.66 J16.VBUS2
  Bottom 0.406: v30.89,4.13 30.38,4.64 16.73,4.64 6.99,14.38 6.99,18.58 v7.06,18.66
  Bottom 0.508: v7.11,23.22 7.11,18.71 v7.06,18.66
VCCA  (via drill 0.3)
  Top 0.203: U4.4 52.7,59.81 C29.1 C30.1 52.7,60.85 v52.7,61.71 | C57.1 C60.1 30.75,51.32 v30.73,51.31 | U7.48 34.65,55.05 C37.1 C38.1 v32.84,56.87 | C35.2 34.8,59.38 35.06,59.65 R5.1 35.06,62.28 35.03,62.31 v35.03,62.36 | U7.33 43.1,52.05 43.4,51.75 C31.1 C32.1 45.53,51.75 v45.57,51.71 | U7.37 41.69,55.05 42.15,55.51 C59.1 42.17,55.53 C58.1 43.41,56.77 v43.41,56.79
  Top 0.254: U7.5 33.19,51.55 32.97,51.33 32.57,51.33 C57.1
  Top 0.508: v43.79,62.38 v43.79,62.39 35.05,62.39 v35.03,62.36
  Bottom 0.203: v32.84,56.87 31.19,58.52 | v45.57,51.71 46.56,51.71 47.83,52.99 | v43.41,56.79 44.48,57.86 44.53,57.86
  Bottom 0.508: v52.83,44.2 52.83,47.99 47.83,52.99 46.48,54.34 46.48,55.91 44.53,57.86 43.79,58.59 v43.79,62.38 v43.79,62.39 44.25,62.84 51.57,62.84 v52.7,61.71 | v30.73,51.31 30.02,52.02 30.02,57.36 31.19,58.52 | v35.03,62.36 31.19,58.52 | 31.19,58.52
  other vias: 56.13,44.2 60.45,44.96 60.45,42.16 60.45,39.37 56.9,37.34 54.86,37.34 53.34,38.1 53.34,39.37 53.34,40.64 53.34,41.91 53.34,43.18 48.26,44.45 48.26,43.18 48.26,41.91 48.26,39.37
  pour Bottom: 60.96,36.83 60.96,45.47 46.98,45.47 46.98,36.83
  pour Top: 46.99,36.83 46.99,45.47 60.96,45.47 60.96,36.83
VDDOUT  (via drill 0.3)
  Top 0.203: U3.22 22.17,29.87 21.56,30.48 C18.1 | C21.1 16.76,20.07 17.01,19.82 U3.39 19.69,19.82 20.06,20.19 21.34,20.19 21.72,19.81 v25.15,19.81 | v25.15,17.27 25.77,17.9 27.83,17.9 28.84,16.89 32.11,16.89 33.36,15.64 33.36,14.58 33.62,14.32 U3.76 36.05,14.32 C22.1 | FB1.2 33,31.54 FB2.2 31.26,31.55 C25.1 31.19,31.52 C24.1 31.17,30.28 U3.4 31.17,27.2 31.09,27.12 31.09,25 30.47,24.38 v25.4,24.38 24.17,25.61 U3.18 24.17,31.85 C17.1
  Top 0.254: U3.22 22.17,26.23 v22.1,26.16
  Bottom 0.203: v22.1,26.16 23.63,26.16 v25.4,24.38 25.15,24.13 v25.15,19.81 v25.15,17.27
  Bottom 0.254: v22.1,26.16
VIN
  Top 0.406: Q1.3 J1.2 J1.1

## Text on the board
Bottom: V21
Measures: 4x 0.130" holes, to clear 4-40 screws. | All dimensions in inches.
tDocu: DEBUG | Jamie Robertson & Byron Jacquot | Revised by: Jamie Robertson & Pete Lewis
bDocu: DEBUG